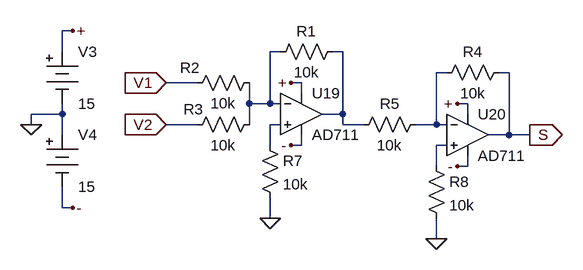
[diagram p0: schematic E7-sumador-analogico.asc]
E7-sumador-analogico.asc, the LTspice schematic file:
Version 4
SHEET 1 1792 804
WIRE -1024 -1184 -1040 -1184
WIRE -1040 -1152 -1040 -1184
WIRE -704 -1152 -720 -1152
WIRE -608 -1152 -624 -1152
WIRE -448 -1120 -464 -1120
WIRE -352 -1120 -368 -1120
WIRE -832 -1104 -880 -1104
WIRE -672 -1104 -688 -1104
WIRE -672 -1088 -672 -1104
WIRE -752 -1072 -752 -1104
WIRE -720 -1072 -720 -1152
WIRE -720 -1072 -752 -1072
WIRE -704 -1072 -720 -1072
WIRE -416 -1072 -432 -1072
WIRE -1040 -1056 -1040 -1072
WIRE -1040 -1056 -1088 -1056
WIRE -608 -1056 -608 -1152
WIRE -608 -1056 -640 -1056
WIRE -416 -1056 -416 -1072
WIRE -1088 -1040 -1088 -1056
WIRE -832 -1040 -880 -1040
WIRE -752 -1040 -752 -1072
WIRE -704 -1040 -720 -1040
WIRE -608 -1040 -608 -1056
WIRE -576 -1040 -608 -1040
WIRE -464 -1040 -464 -1120
WIRE -464 -1040 -496 -1040
WIRE -448 -1040 -464 -1040
WIRE -1040 -1024 -1040 -1056
WIRE -352 -1024 -352 -1120
WIRE -352 -1024 -384 -1024
WIRE -320 -1024 -352 -1024
WIRE -720 -1008 -720 -1040
WIRE -672 -1008 -672 -1024
WIRE -672 -1008 -688 -1008
WIRE -448 -1008 -464 -1008
WIRE -464 -976 -464 -1008
WIRE -416 -976 -416 -992
WIRE -416 -976 -432 -976
WIRE -1040 -912 -1040 -944
WIRE -1024 -912 -1040 -912
WIRE -720 -896 -720 -928
WIRE -464 -864 -464 -896
FLAG -720 -896 0
FLAG -464 -864 0
FLAG -1024 -1184 +
FLAG -1024 -912 -
FLAG -1088 -1040 0
FLAG -688 -1104 +
FLAG -432 -1072 +
FLAG -688 -1008 -
FLAG -432 -976 -
FLAG -880 -1104 V1
IOPIN -880 -1104 In
FLAG -880 -1040 V2
IOPIN -880 -1040 In
FLAG -320 -1024 S
IOPIN -320 -1024 Out
SYMBOL res -608 -1168 R90
WINDOW 0 0 56 VBottom 2
WINDOW 3 32 56 VTop 2
SYMATTR InstName R1
SYMATTR Value 10k
SYMBOL res -736 -1120 R90
WINDOW 0 8 107 VBottom 2
WINDOW 3 32 56 VTop 2
SYMATTR InstName R2
SYMATTR Value 10k
SYMBOL res -736 -1056 R90
WINDOW 0 8 102 VBottom 2
WINDOW 3 32 56 VTop 2
SYMATTR InstName R3
SYMATTR Value 10k
SYMBOL res -352 -1136 R90
WINDOW 0 0 56 VBottom 2
WINDOW 3 32 56 VTop 2
SYMATTR InstName R4
SYMATTR Value 10k
SYMBOL res -480 -1056 R90
WINDOW 0 0 56 VBottom 2
WINDOW 3 32 56 VTop 2
SYMATTR InstName R5
SYMATTR Value 10k
SYMBOL Misc\\battery -1040 -1168 R0
SYMATTR InstName V3
SYMATTR Value 15
SYMBOL Misc\\battery -1040 -1040 R0
SYMATTR InstName V4
SYMATTR Value 15
SYMBOL res -736 -1024 R0
SYMATTR InstName R7
SYMATTR Value 10k
SYMBOL res -480 -992 R0
SYMATTR InstName R8
SYMATTR Value 10k
SYMBOL Opamps\\AD711 -672 -1120 R0
SYMATTR InstName U19
SYMBOL Opamps\\AD711 -416 -1088 R0
SYMATTR InstName U20

The netlist it stands for:
* E7-sumador-analogico.asc
R1 N002 N001 10k
R2 N001 V1 10k
R3 N001 V2 10k
R4 S N003 10k
R5 N003 N002 10k
V3 + 0 15
V4 0 - 15
R7 N004 0 10k
R8 N005 0 10k
XU19 N004 N001 + - N002 AD712  ; AD711, pins In+ In- V+ V- OUT
XU20 N005 N003 + - S AD712  ; AD711, pins In+ In- V+ V- OUT
.lib ADI1.lib
.backanno
.end